# Altium schematic sheet Power.SchDoc: Power circuit
size A4; Revision: 1-1; SheetNumber: 2; SheetTotal: 6
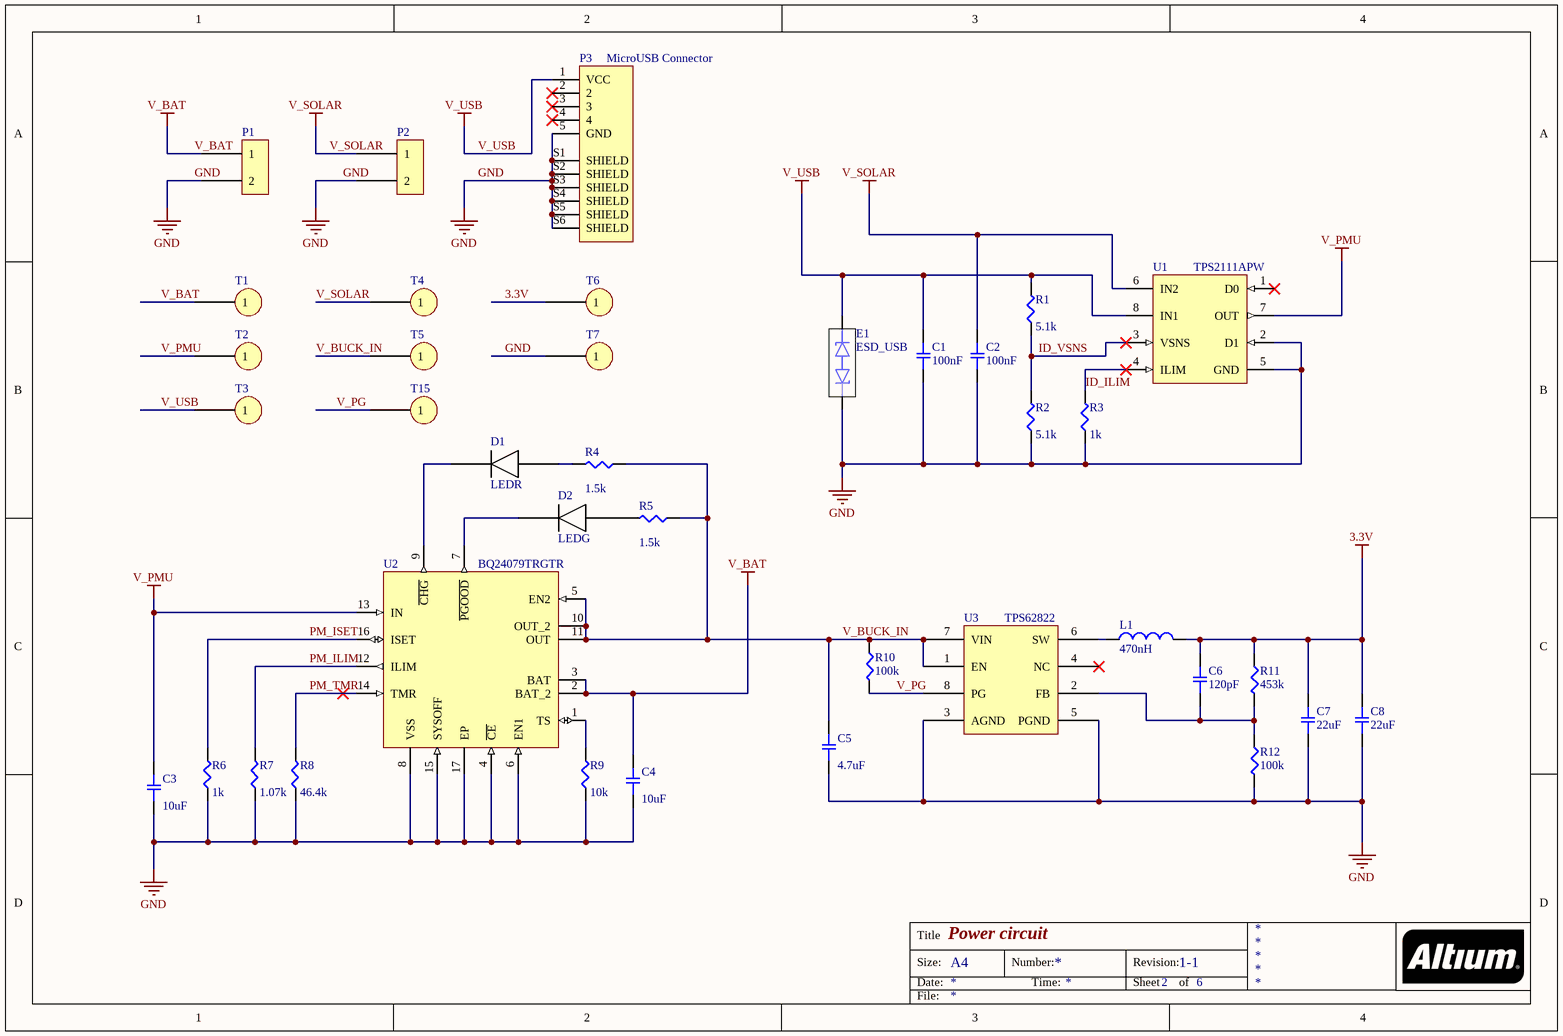
[diagram p0: Power.SchDoc]

## Parts
C1  value 100nF  [1206-CAP]  (hidden comment: 1206C 100NF)
C2  value 100nF  [1206-CAP]  (hidden comment: 1206C 100NF)
C3  value 10uF  [0805-CAP]  (hidden comment: 0805C 10UF)
C4  value 10uF  [0805-CAP]  (hidden comment: 0805C 10UF)
C5  value 4.7uF  [0603-CAP]  (hidden comment: 0603C 4U7F)
C6  value 120pF  [0603-CAP]  (hidden comment: 0603C 120PF)
C7  value 22uF  [1210-CAP]  (hidden comment: 1210C 22UF)
C8  value 22uF  [1210-CAP]  (hidden comment: 1210C 22UF)
D1  LEDR  [0603-LED]
D2  LEDG  [0603-LED]
E1  ESD_USB  [ESD_USB]
L1  value 470nH  [Inductor 470NH]  (hidden comment: Inductor 470NH)
P1  2pins_connector  [2_PINS_2.54]  (value not drawn)
P2  2pins_connector  [2_PINS_2.54]  (value not drawn)
P3  value MicroUSB Connector  [*HRS_ZX62D-B-5P8_ZX62D-B-5P8(Primary)]  (hidden comment: ZX62D-B-5P8)
R1  value 5.1k  [0805-RES]  (hidden comment: 0805R 5K1R)
R2  value 5.1k  [0805-RES]  (hidden comment: 0805R 5K1R)
R3  value 1k  [0603-RES]  (hidden comment: 0603R 1KR)
R4  value 1.5k  [0603-RES]  (hidden comment: 0603R 1K5R)
R5  value 1.5k  [0603-RES]  (hidden comment: 0603R 1K5R)
R6  value 1k  [0603-RES]  (hidden comment: 0603R 1KR)
R7  value 1.07k  [0603-RES]  (hidden comment: 0603R 1K07R)
R8  value 46.4k  [0603-RES]  (hidden comment: 0603R 46K4R)
R9  value 10k  [0603-RES]  (hidden comment: 0603R 10KR)
R10  value 100k  [0805-RES]  (hidden comment: 0805R 100KR)
R11  value 453k  [0805-RES]  (hidden comment: 0805R 453KR)
R12  value 100k  [0805-RES]  (hidden comment: 0805R 100KR)
T1  1pin_header  [1_PIN_2.54]  (value not drawn)
T2  1pin_header  [1_PIN_2.54]  (value not drawn)
T3  1pin_header  [1_PIN_2.54]  (value not drawn)
T4  1pin_header  [1_PIN_2.54]  (value not drawn)
T5  1pin_header  [1_PIN_2.54]  (value not drawn)
T6  1pin_header  [1_PIN_2.54]  (value not drawn)
T7  1pin_header  [1_PIN_2.54]  (value not drawn)
T15  *  [1_PIN_2.54]  (value not drawn)
U1  TPS2111APW  [*SOP65P640X120-8N]
U2  BQ24079TRGTR  [*QFN50P300X300X100-17N]
U3  TPS62822  [SON50P150X100_HS-9N]

## Nets
3.3V: C6.2 C7.2 C8.2 L1.2 R11.1 T6.1
GND: C1.1 C2.1 C3.1 C4.1 C5.1 C7.1 C8.1 E1.1 P1.2 P2.2 P3.5(GND) P3.S1(SHIELD) P3.S2(SHIELD) P3.S3(SHIELD) P3.S4(SHIELD) P3.S5(SHIELD) P3.S6(SHIELD) R2.1 R3.1 R6.1 R7.1 R8.1 R9.1 R12.2 T7.1 U1.2(D1) U1.5(GND) U2.4(~{CE}) U2.6(EN1) U2.8(VSS) U2.15(SYSOFF) U2.17(EP) U3.3(AGND) U3.5(PGND)
V_BAT: C4.2 P1.1 T1.1 U2.2(BAT_2) U2.3(BAT)
V_PMU: C3.2 T2.1 U1.7(OUT) U2.13(IN)
V_SOLAR: C2.2 P2.1 T4.1 U1.6(IN2)
V_USB: C1.2 E1.2 P3.1(VCC) R1.2 T3.1 U1.8(IN1)
ID_ILIM: R3.2 U1.4(ILIM)
ID_VSNS: R1.1 R2.2 U1.3(VSNS)
PM_ILIM: R7.2 U2.12(ILIM)
PM_ISET: R6.2 U2.16(ISET)
PM_TMR: R8.2 U2.14(TMR)
V_BUCK_IN: C5.2 R4.1 R5.1 R10.1 T5.1 U2.5(EN2) U2.10(OUT_2) U2.11(OUT) U3.1(EN) U3.7(VIN)
V_PG: R10.2 T15.1 U3.8(PG)
NetC6_1: C6.1 R11.2 R12.1 U3.2(FB)
NetD1_1: D1.1 R4.2
NetD1_2: D1.2 U2.9(~{CHG})
NetD2_1: D2.1 R5.2
NetD2_2: D2.2 U2.7(~{PGOOD})
NetL1_1: L1.1 U3.6(SW)
NetR9_2: R9.2 U2.1(TS)

Not connected (* = marked no-connect by the designer): P3 2* 3* 4*; U1 1(D0)*; U3 4(NC)*

## Notes on the sheet
- Title
- Size:
- Date:
- A4
- Number:
- Time:
- Revision:
- Sheet
- of
- File:

## Library data of the parts
D1 = 0603 LEDR: Supplier 1: Digi-Key; Supplier Part Number 1: 160-1181-6-ND
D2 = 0603 LEDG: Supplier 1: Digi-Key; Supplier Part Number 1: 160-1183-6-ND
P1 P2 = 2pins_connector: Bat_connector
P3 = ZX62D-B-5P8: USB - micro B USB 2.0 Receptacle Connector 5 Position Surface Mount, Right Angle; Through Hole; MF: Hirose; SnapEDA_Link: https://www.snapeda.com/parts/ZX62D-B-5P8/Hirose%20Electric%20Co%20Ltd/view-part/110243/?ref=snap; Price: None; Availability: Unavailable; Package: None; MP: ZX62D-B-5P8; Supplier 1: Digi-Key; Supplier Part Number 1: 609-5379-6-ND
T15 = 1pin_header
U1 = TPS2111APW: OR Controller Source Selector Switch N-Channel 2:1 8-TSSOP; MF: Texas Instruments; MP: TPS2110APWR; Package: TSSOP-8 Texas Instruments; Price: 2.34; SnapEDA_Link: https://www.snapeda.com/parts/TPS2111APW/Texas%20Instruments/view-part/299213/?ref=snap; Value: *; datasheet link: https://www.ti.com/lit/ds/symlink/tps2111a.pdf; Digikey link: https://www.digikey.com/product-detail/en/texas-instruments/TPS2110APWR/296-16935-1-ND/652789; Supplier 1: Digi-Key; Supplier Part Number 1: 296-26917-5-ND
U2 = BQ24079TRGTR: MF: Texas Instruments; MP: BQ24079RGTR; SnapEDA_Link: https://www.snapeda.com/parts/BQ24079TRGTR/Texas%20Instruments/view-part/144669/?ref=snap; Value: *; Digikey link: https://www.digikey.com/product-detail/en/texas-instruments/BQ24079RGTR/296-24815-1-ND/2094655; Package: 16-VFQFN Exposed Pad; Price: 2.21; Datasheet link: http://www.ti.com/lit/ds/symlink/bq24079.pdf; Supplier 1: Digi-Key; Supplier Part Number 1: 296-24815-1-ND
U3 = TPS62822: MF: Texas Instruments; MP: TPS62822DLCR; datasheet link: http://www.ti.com/lit/ds/symlink/tps62822.pdf; Digikey number: 296-50424-1-ND; Package: 8-VFDFN; digikey link: https://www.digikey.com/product-detail/en/texas-instruments/TPS62822DLCR/296-50424-1-ND/9685563; Supplier 1: Digi-Key; Supplier Part Number 1: 296-50424-1-ND
C1 C2 = 1206C 100NF: Package: 1206; Supplier 1: Digi-Key; Supplier Part Number 1: 311-1179-6-ND
C3 C4 = 0805C 10UF: Supplier 1: Digi-Key; Supplier Part Number 1: 445-7617-1-ND
C5 = 0603C 4U7F: Supplier 1: Digi-Key; Supplier Part Number 1: 399-3482-1-ND
C6 = 0603C 120PF: Supplier 1: Digi-Key; Supplier Part Number 1: 490-1429-1-ND
C7 C8 = 1210C 22UF: Supplier 1: Digi-Key; Supplier Part Number 1: 490-10560-1-ND
E1 = ESD_USB: Supplier 1: Digi-Key; Supplier Part Number 1: 1727-3838-1-ND
L1 = Inductor 470NH: Supplier 1: Digi-Key; Supplier Part Number 1: 445-3878-1-ND
R1 R2 = 0805R 5K1R: Supplier 1: Digi-Key; Supplier Part Number 1: 2019-RK73H2ATTD5101FCT-ND
R3 R6 = 0603R 1KR: Package: 0603; Supplier 1: Digi-Key; Supplier Part Number 1: 311-1.00KHRDKR-ND
R4 R5 = 0603R 1K5R: Package: 0603; Supplier 1: Digi-Key; Supplier Part Number 1: 311-1.50KHRCT-ND
R7 = 0603R 1K07R: Package: 0603; Supplier 1: Digi-Key; Supplier Part Number 1: 311-1.07KHRCT-ND
R8 = 0603R 46K4R: Package: 0603; Supplier 1: Digi-Key; Supplier Part Number 1: 311-46.4KHRCT-ND
R9 = 0603R 10KR: Package: 0603; Supplier 1: Digi-Key; Supplier Part Number 1: 311-10.0KHRCT-ND
R10 R12 = 0805R 100KR: Supplier 1: Digi-Key; Supplier Part Number 1: P100KCCT-ND
R11 = 0805R 453KR: Supplier 1: Digi-Key; Supplier Part Number 1: P453KCCT-ND